# EAGLE design ANS_1_1 (EAGLE 7.6.0)
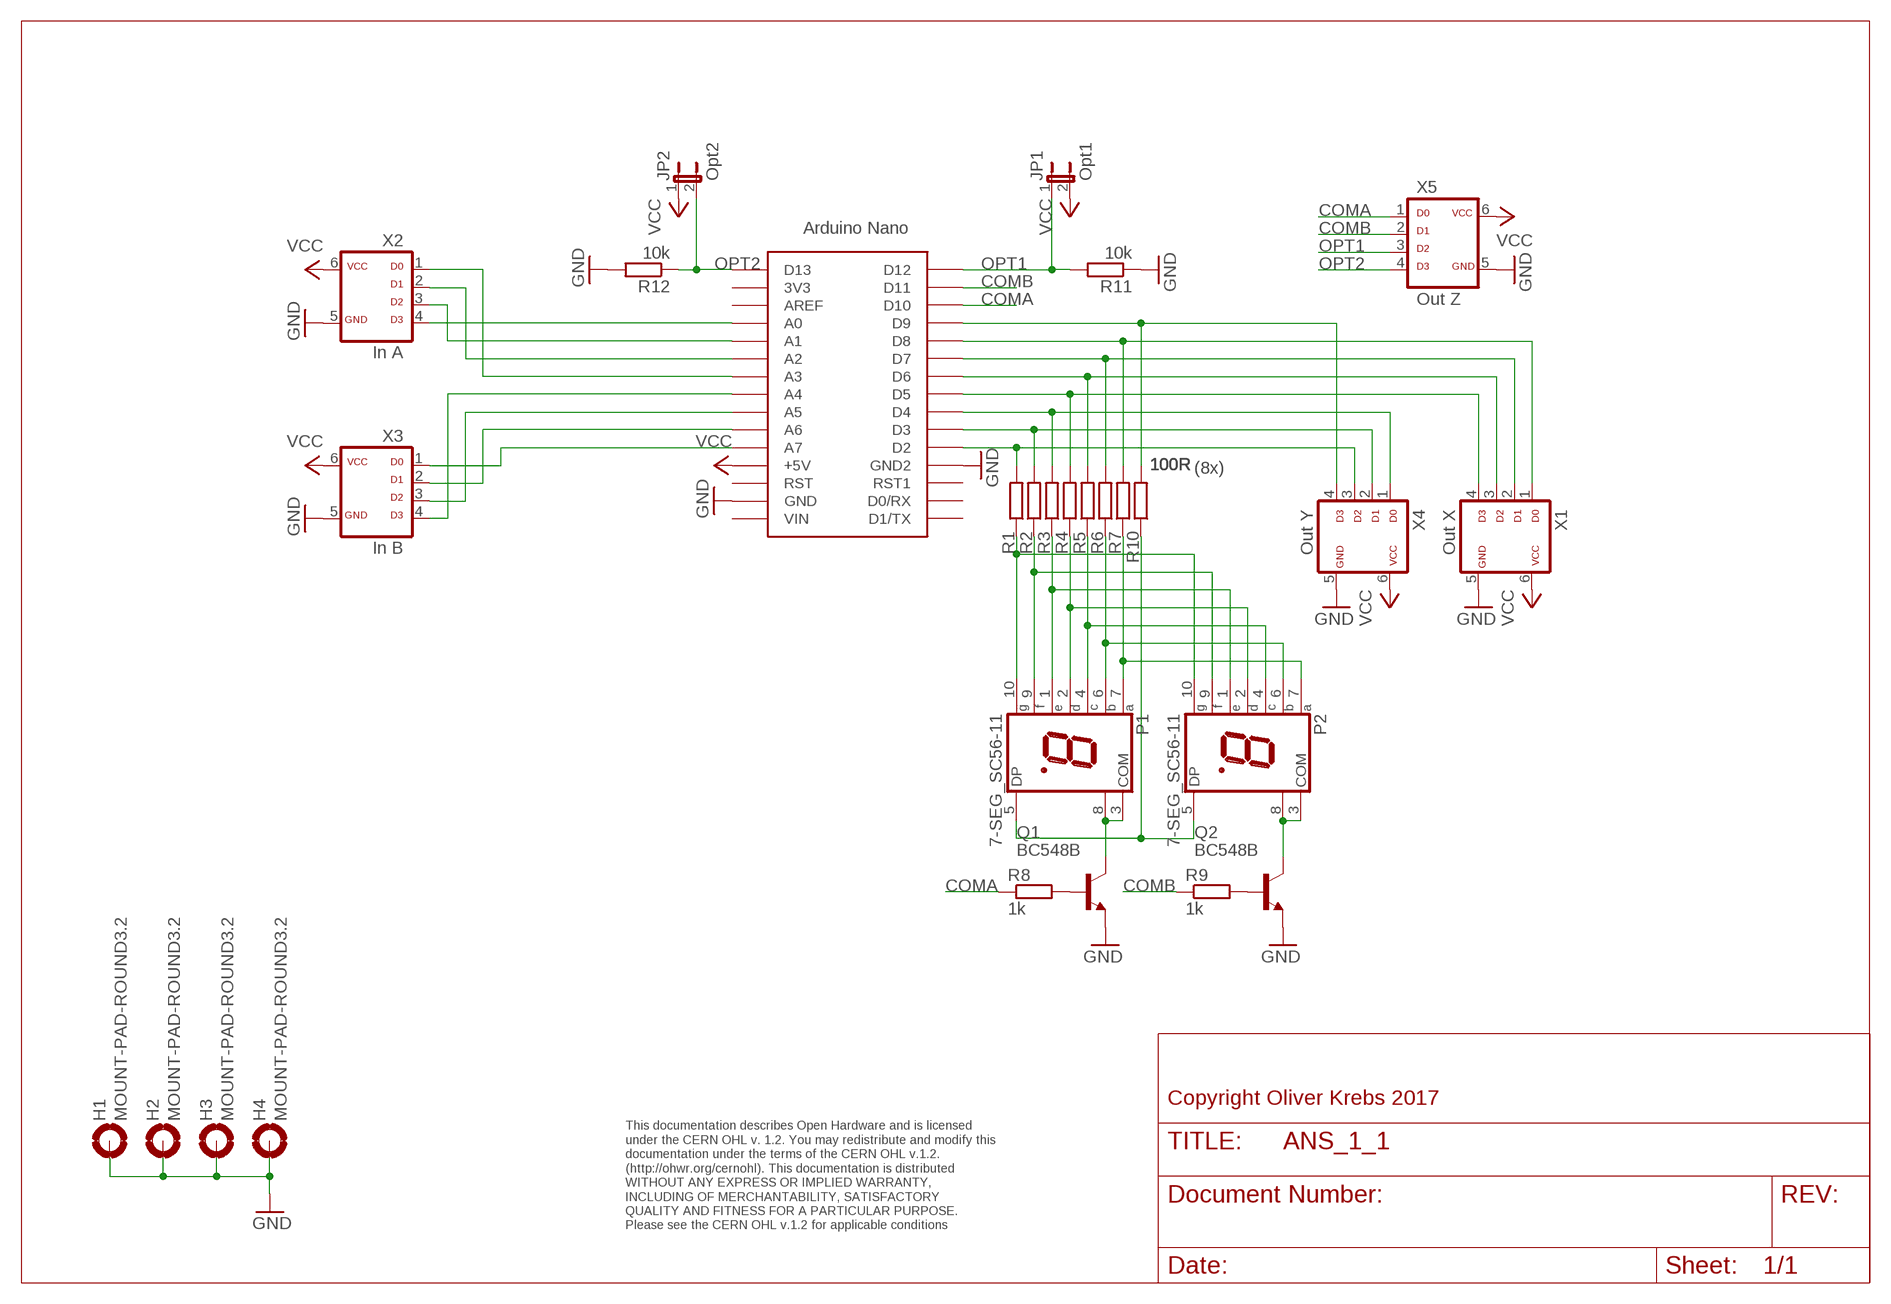
[diagram p0: schematic, sheet 1]

## Parts
H1  MOUNT-PAD-ROUND3.2  [3,2-PAD]
H2  MOUNT-PAD-ROUND3.2  [3,2-PAD]
H3  MOUNT-PAD-ROUND3.2  [3,2-PAD]
H4  MOUNT-PAD-ROUND3.2  [3,2-PAD]
JP1  Opt1  JP1E  [JP1]
JP2  Opt2  JP1E  [JP1]
P1  7-SEG_SC56-11  7-SEG_SA56-11  [SA56-11]
P2  7-SEG_SC56-11  7-SEG_SA56-11  [SA56-11]
Q1  BC548B  [TO92-EBC]
Q2  BC548B  [TO92-EBC]
R1  100R  R-EU_0207/10  [0207/10]
R2  100R  R-EU_0207/10  [0207/10]
R3  100R  R-EU_0207/10  [0207/10]
R4  100R  R-EU_0207/10  [0207/10]
R5  100R  R-EU_0207/10  [0207/10]
R6  100R  R-EU_0207/10  [0207/10]
R7  100R  R-EU_0207/10  [0207/10]
R8  1k  R-EU_0207/10  [0207/10]
R9  1k  R-EU_0207/10  [0207/10]
R10  100R  R-EU_0207/10  [0207/10]
R11  10k  R-EU_0207/10  [0207/10]
R12  10k  R-EU_0207/10  [0207/10]
U$1  NANO  [NANO]
X1  Out X  ML6D  [ML-6]
X2  In A  ML6D  [ML-6]
X3  In B  ML6D  [ML-6]
X4  Out Y  ML6D  [ML-6]
X5  Out Z  ML6D  [ML-6]

## Nets
COMA: R8.1 U$1.D10 X5.1
COMB: R9.1 U$1.D11 X5.2
GND: H1.B3,2(MOUNT) H2.B3,2(MOUNT) H3.B3,2(MOUNT) H4.B3,2(MOUNT) Q1.E Q2.E R11.1 R12.2 U$1.GND U$1.GND1(GND2) X1.5 X2.5 X3.5 X4.5 X5.5
N$1: U$1.A0 X2.4
N$2: U$1.A1 X2.3
N$3: U$1.A2 X2.2
N$4: U$1.A3 X2.1
N$5: U$1.A4 X3.4
N$6: U$1.A5 X3.3
N$7: U$1.A6 X3.2
N$8: U$1.A7 X3.1
N$9: P1.10(G) P2.10(G) R1.1
N$10: P1.9(F) P2.9(F) R2.1
N$11: P1.1(E) P2.1(E) R3.1
N$12: P1.2(D) P2.2(D) R4.1
N$13: P1.4(C) P2.4(C) R5.1
N$14: P1.6(B) P2.6(B) R6.1
N$15: P1.7(A) P2.7(A) R7.1
N$16: R1.2 U$1.D2 X4.3
N$17: R2.2 U$1.D3 X4.2
N$18: R3.2 U$1.D4 X4.1
N$19: R4.2 U$1.D5 X1.4
N$20: R5.2 U$1.D6 X1.3
N$21: R6.2 U$1.D7 X1.2
N$22: R7.2 U$1.D8 X1.1
N$23: P1.3(COM) P1.8(COM) Q1.C
N$24: P2.3(COM) P2.8(COM) Q2.C
N$25: Q1.B R8.2
N$26: Q2.B R9.2
N$27: R10.2 U$1.D9 X4.4
N$28: P1.5(DP) P2.5(DP) R10.1
OPT1: JP1.1 R11.2 U$1.D12 X5.3
OPT2: JP2.2 R12.1 U$1.D13 X5.4
VCC: JP1.2 JP2.1 U$1.5V(+5V) X1.6 X2.6 X3.6 X4.6 X5.6
Unconnected: U$1.3.3V(3V3) U$1.AREF U$1.RAW(VIN) U$1.RST U$1.RST1 U$1.RX1(D0/RX) U$1.TX0(D1/TX)

## Notes on the sheet
- (8x)
- Copyright Oliver Krebs 2017
- This documentation describes Open Hardware and is licensed 
  under the CERN OHL v. 1.2. You may redistribute and modify this 
  documentation under the terms of the CERN OHL v.1.2. 
  (http://ohwr.org/cernohl). This documentation is distributed
  WITHOUT ANY EXPRESS OR IMPLIED WARRANTY, 
  INCLUDING OF MERCHANTABILITY, SATISFACTORY 
  QUALITY AND FITNESS FOR A PARTICULAR PURPOSE. 
  Please see the CERN OHL v.1.2 for applicable conditions

## Library data of the parts
H1-H4 = holes:MOUNT-PAD-ROUND: MOUNTING PAD, round
JP1 JP2 = 01-my-jumper:JP1E: JUMPER
P1 P2 = display-kingbright:7-SEG_: Kingbright 14.2mm (0.56 INCH) SINGLE DIGIT NUMERIC DUISPLAY Source: SA56-11EWA(Ver1189471036.pdf; OC_FARNELL: unknown; OC_NEWARK: unknown
Q1 Q2 = transistor-npn:BC548*: NPN Transistor
R1-R12 = 01-my_rcl:R-EU_: RESISTOR, European symbol
U$1 = Arduino-clone:NANO: Arduino Nano
X1-X5 = 01-my-con:ML6D

## Board
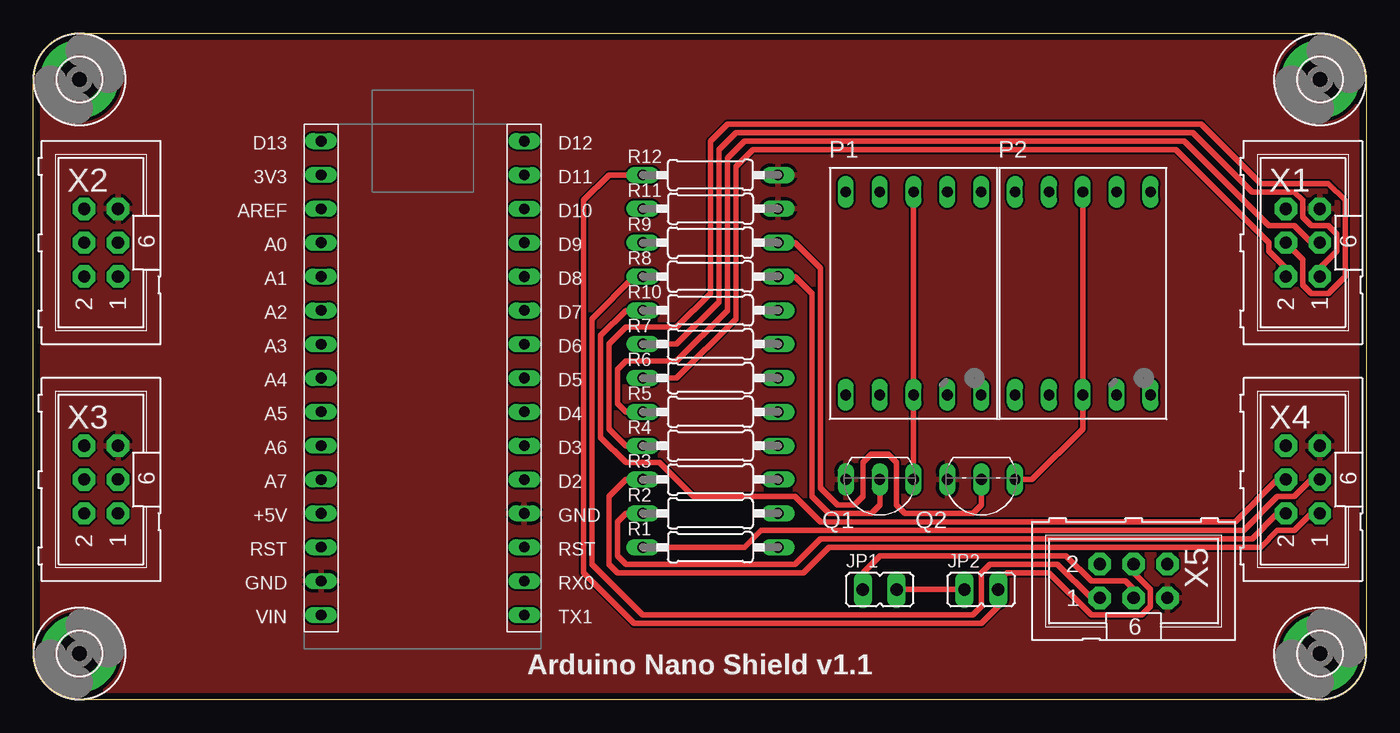
[diagram p1: board, top side]
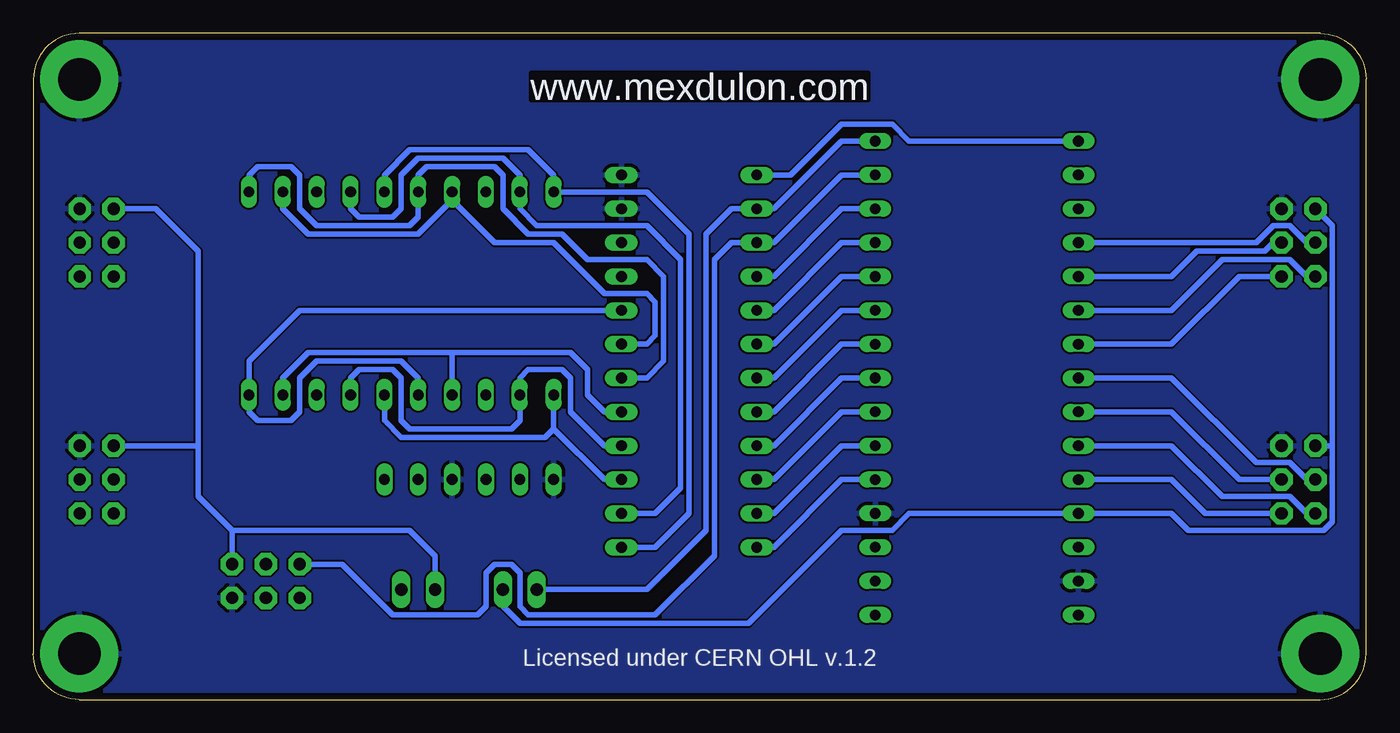
[diagram p2: board, bottom side, seen from below]

Size 100 x 50 mm. Coordinates in mm from the lower left corner, seen from the top.
Outline: 0,3.45 0,46.55 arc-90 3.45,50 96.55,50 arc-90 100,46.55 100,3.45 arc-90 96.55,0 3.45,0 arc-90 0,3.45
Copper layers (1*16): Top 0.035mm / dielectric 1.6mm / Bottom 0.035mm
Design rules "Elecrow_2-layer_PCB_eagle_rule": minimum track width 6mil, minimum drill 12mil, track to track 6mil, track to pad 6mil, pad to pad 6mil, via to via 8mil, smd to smd 0mil, copper to edge 20mil, drill to drill 10mil, minimum pad ring 6mil, minimum via ring 6mil, stop-mask expansion 0mil, vias tented up to drill 100mil, thermal gap 10mil

### Footprints (pad centres in the part's own frame; a part is rotated, then mirrored left to right if it is on the bottom)
3,2-PAD = drill 3.2 pad 5.842: B3,2 0,0
JP1 = drill 0.914 long: 1 0,-1.27; 2 0,1.27
SA56-11 = drill 0.8 long: 1 -5.08,-7.62; 2 -2.54,-7.62; 3 0,-7.62; 4 2.54,-7.62; 5 5.08,-7.62; 6 5.08,7.62; 7 2.54,7.62; 8 0,7.62; 9 -2.54,7.62; 10 -5.08,7.62
TO92-EBC = drill 0.813 long: B 0,-1.27; C -2.54,-1.27; E 2.54,-1.27
0207/10 = drill 0.813 long: 1 -5.08,0; 2 5.08,0
NANO = drill 0.8 long: 3.3V -10.16,24.13; 5V -10.16,-1.27; A0 -10.16,19.05; A1 -10.16,16.51; A2 -10.16,13.97; A3 -10.16,11.43; A4 -10.16,8.89; A5 -10.16,6.35; A6 -10.16,3.81; A7 -10.16,1.27; AREF -10.16,21.59; D2 5.08,1.27; D3 5.08,3.81; D4 5.08,6.35; D5 5.08,8.89; D6 5.08,11.43; D7 5.08,13.97; D8 5.08,16.51; D9 5.08,19.05; D10 5.08,21.59; D11 5.08,24.13; D12 5.08,26.67; D13 -10.16,26.67; GND -10.16,-6.35; GND1 5.08,-1.27; RAW -10.16,-8.89; RST -10.16,-3.81; RST1 5.08,-3.81; RX1 5.08,-6.35; TX0 5.08,-8.89
ML-6 = drill 0.914 pad 1.676 octagon: 1 -2.54,-1.27; 2 -2.54,1.27; 3 0,-1.27; 4 0,1.27; 5 2.54,-1.27; 6 2.54,1.27

### Placement (x,y rotation side)
H1  3.45,3.45 0 top
H2  3.45,46.55 0 top
H3  96.55,3.45 0 top
H4  96.55,46.55 0 top
JP1  63.5,8.26 270 top
JP2  71.12,8.26 270 top
P1  66.04,30.48 0 top
P2  78.74,30.48 0 top
Q1  63.5,15.24 180 top
Q2  71.12,15.24 180 top
R1  50.8,11.43 180 top
R2  50.8,13.97 180 top
R3  50.8,16.51 180 top
R4  50.8,19.05 180 top
R5  50.8,21.59 180 top
R6  50.8,24.13 180 top
R7  50.8,26.67 180 top
R8  50.8,31.75 0 top
R9  50.8,34.29 0 top
R10  50.8,29.21 180 top
R11  50.8,36.83 180 top
R12  50.8,39.37 0 top
U$1  31.75,15.24 0 top
X1  95.25,34.29 90 top
X2  5.08,34.29 90 top
X3  5.08,16.51 90 top
X4  95.25,16.51 90 top
X5  82.55,8.89 0 top

### Tracks (layer width: path | path; a pad name or v marks a point on that pad's centre or on a via)
COMA
  Top 0.406: R8.1 45.09,31.75 41.91,28.57 41.91,10.16 45.72,6.35 70.48,6.35 71.12,6.99 71.12,9.53 71.75,10.16 76.83,10.16 79.38,7.62 X5.1
  Bottom 0.406: U$1.D10 39.37,36.83 44.45,31.75 R8.1
COMB
  Bottom 0.406: U$1.D11 39.37,39.37 44.45,34.29 R9.1 47.62,34.29 48.9,33.02 48.9,10.79 53.34,6.35 62.87,6.35 63.5,6.99 63.5,9.53 64.14,10.16 65.41,10.16 66.04,9.53 66.04,6.99 66.67,6.35 73.03,6.35 76.83,10.16 X5.2
GND
  pour Bottom: 0,0 100.8,0 100.8,50.8 0,50.8
  pour Top: 0,50.16 100.17,50.16 100.17,0 0,0
N$1
  Bottom 0.406: U$1.A0 8.26,34.29 6.99,35.56 5.71,35.56 4.45,34.29 X2.4
N$2
  Bottom 0.406: X2.3 6.99,34.29 7.62,33.66 12.7,33.66 14.61,31.75 U$1.A1
N$3
  Bottom 0.406: U$1.A2 14.61,29.21 10.79,33.02 5.71,33.02 4.45,31.75 X2.2
N$4
  Bottom 0.406: X2.1 9.53,31.75 14.61,26.67 U$1.A3
N$5
  Bottom 0.406: X3.4 4.45,16.51 5.71,17.78 8.26,17.78 14.61,24.13 U$1.A4
N$6
  Bottom 0.406: X3.3 9.53,16.51 14.61,21.59 U$1.A5
N$7
  Bottom 0.406: X3.2 4.45,13.97 5.71,15.24 10.79,15.24 14.61,19.05 U$1.A6
N$8
  Bottom 0.406: X3.1 12.06,13.97 14.61,16.51 U$1.A7
N$9
  Bottom 0.406: P2.10 73.66,39.37 71.75,41.27 62.87,41.27 60.96,39.37 P1.10 53.98,38.1 50.8,34.92 50.8,13.97 53.34,11.43 R1.1
N$10
  Bottom 0.406: P2.9 76.2,36.83 75.56,36.2 73.03,36.2 72.39,36.83 72.39,39.37 71.12,40.64 64.77,40.64 63.5,39.37 P1.9 63.5,36.83 62.23,35.56 53.98,35.56 51.44,33.02 51.44,15.88 53.34,13.97 R2.1
N$11
  Bottom 0.406: P1.1 60.96,20.32 | 60.96,20.32 61.59,19.68 72.39,19.68 73.66,20.95 P2.1 | R3.1 57.15,16.51 60.96,20.32
N$12
  Bottom 0.406: P2.2 76.2,24.13 75.56,24.77 73.03,24.77 72.39,24.13 72.39,20.95 71.75,20.32 64.14,20.32 63.5,20.95 P1.2 63.5,24.13 62.87,24.77 60.33,24.77 59.69,24.13 59.69,21.59 57.15,19.05 R4.1
N$13
  Bottom 0.406: P1.4 68.58,26.04 | 68.58,26.04 79.38,26.04 81.28,24.13 P2.4 | 68.58,26.04 59.69,26.04 58.42,24.77 58.42,22.86 57.15,21.59 R5.1
N$14
  Bottom 0.406: P2.6 83.82,39.37 83.19,40.01 80.64,40.01 80.01,39.37 80.01,36.83 78.74,35.56 71.75,35.56 71.12,36.2 P1.6 71.12,39.37 70.48,40.01 65.41,40.01 64.77,39.37 64.77,36.83 62.87,34.92 60.33,34.92 58.42,33.02 53.98,33.02 52.7,31.75 52.7,25.4 53.98,24.13 R6.1
N$15
  Bottom 0.406: P2.7 81.28,36.83 79.38,34.92 71.12,34.92 68.58,37.47 | R7.1 53.98,26.67 53.34,27.3 53.34,29.84 53.98,30.48 57.15,30.48 60.96,34.29 65.41,34.29 68.58,37.47 | 68.58,37.47 P1.7
N$16
  Top 0.406: R1.2 53.34,11.43 54.61,12.7 90.81,12.7 93.34,15.24 94.61,15.24 95.89,16.51 X4.3
  Bottom 0.406: U$1.D2 39.37,16.51 44.45,11.43 R1.2
N$17
  Top 0.406: R2.2 44.45,13.97 43.81,13.34 43.81,10.79 44.45,10.16 57.15,10.16 59.05,12.06 91.44,12.06 93.34,13.97 X4.2
  Bottom 0.406: U$1.D3 39.37,19.05 44.45,13.97 R2.2
N$18
  Top 0.406: R3.2 44.45,16.51 43.18,15.24 43.18,10.16 43.81,9.53 57.78,9.53 59.69,11.43 92.08,11.43 93.34,12.7 94.61,12.7 95.89,13.97 X4.1
  Bottom 0.406: U$1.D4 39.37,21.59 44.45,16.51 R3.2
N$19
  Top 0.406: R4.2 44.45,19.05 43.18,20.32 43.18,26.67 44.45,27.94 48.26,27.94 50.8,30.48 50.8,41.91 52.07,43.18 87.63,43.18 92.08,38.73 97.16,38.73 98.42,37.47 98.42,31.75 97.16,30.48 95.89,30.48 95.25,31.11 95.25,33.02 X1.4
  Bottom 0.406: U$1.D5 39.37,24.13 44.45,19.05 R4.2
N$20
  Top 0.406: R5.2 44.45,21.59 43.81,22.23 43.81,24.77 44.45,25.4 48.26,25.4 52.07,29.21 52.07,40.64 53.34,41.91 86.36,41.91 92.71,35.56 94.61,35.56 95.89,34.29 X1.3
  Bottom 0.406: U$1.D6 39.37,26.67 44.45,21.59 R5.2
N$21
  Top 0.406: R6.2 48.26,24.13 52.7,28.57 52.7,40.01 53.98,41.27 85.72,41.27 92.71,34.29 92.71,33.66 93.98,32.38 X1.2
  Bottom 0.406: U$1.D7 39.37,29.21 44.45,24.13 R6.2
N$22
  Top 0.406: R7.2 48.26,26.67 51.44,29.84 51.44,41.27 52.7,42.55 87,42.55 91.44,38.1 94.61,38.1 95.25,37.47 95.25,36.2 95.89,35.56 97.16,35.56 97.79,34.92 97.79,33.66 96.52,32.38 X1.1
  Bottom 0.406: U$1.D8 39.37,31.75 44.45,26.67 R7.2
N$23
  Top 0.406: P1.8 P1.3 Q1.C
N$24
  Top 0.406: P2.8 P2.3 78.74,20.32 74.93,16.51 Q2.C
N$25
  Top 0.406: R8.2 57.15,31.75 58.42,30.48 58.42,15.24 59.69,13.97 62.87,13.97 63.5,14.61 Q1.B
N$26
  Top 0.406: R9.2 57.15,34.29 59.05,32.38 59.05,15.88 60.33,14.61 61.59,14.61 62.23,15.24 62.23,17.78 62.87,18.41 64.14,18.41 64.77,17.78 64.77,14.61 65.41,13.97 70.48,13.97 71.12,14.61 Q2.B
N$27
  Top 0.406: R10.2 44.45,29.21 42.55,27.3 42.55,19.68 44.45,17.78 46.99,17.78 49.53,15.24 57.15,15.24 59.05,13.34 90.17,13.34 93.34,16.51 X4.4
  Bottom 0.406: U$1.D9 39.37,34.29 44.45,29.21 R10.2
N$28
  Bottom 0.406: P1.5 71.12,24.13 72.39,25.4 78.74,25.4 80.01,24.13 80.01,21.59 80.64,20.95 83.19,20.95 83.82,21.59 P2.5 83.82,25.4 80.01,29.21 R10.1
OPT1
  Top 0.406: JP1.1 62.23,9.53 63.5,10.79 77.47,10.79 79.38,8.89 81.92,8.89 82.55,8.26 X5.3
  Bottom 0.406: U$1.D12 39.37,41.91 44.45,36.83 R11.2 47.62,36.83 49.53,34.92 49.53,12.7 53.98,8.26 JP1.1
OPT2
  Top 0.406: R12.1 43.18,39.37 41.27,37.47 41.27,9.53 45.09,5.71 71.12,5.71 72.39,6.99 JP2.2 72.39,8.89 73.03,9.53 76.2,9.53 79.38,6.35 83.19,6.35 83.82,6.99 83.82,8.26 82.55,9.53 X5.4
  Bottom 0.406: U$1.D13 34.29,41.91 35.56,43.18 39.37,43.18 43.18,39.37 R12.1
VCC
  Top 0.406: JP1.2 JP2.1
  Bottom 0.406: X3.6 2.54,19.05 | 2.54,19.05 2.54,13.34 3.17,12.7 13.34,12.7 14.61,13.97 U$1.5V 34.29,13.97 35.56,12.7 39.37,12.7 46.35,5.71 63.5,5.71 64.77,6.99 JP1.2 | X2.6 2.54,35.56 2.54,19.05 | X4.6 87.63,19.05 | X1.6 90.81,36.83 87.63,33.66 87.63,19.05 | JP2.1 69.85,10.79 71.75,12.7 85.09,12.7 | 85.09,12.7 87.63,15.24 87.63,19.05 | X5.6 85.09,12.7

### Text on the board
Bottom: www.mexdulon.com
tNames: Arduino Nano Shield v1.1
bNames: www.mexdulon.com | Licensed under CERN OHL v.1.2